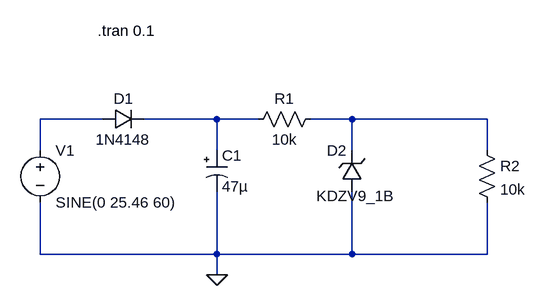
[diagram p0: schematic moduloAlimentacao.asc]
moduloAlimentacao.asc, the LTspice schematic file:
Version 4
SHEET 1 948 680
WIRE 288 48 192 48
WIRE 464 48 352 48
WIRE 528 48 464 48
WIRE 672 48 608 48
WIRE 880 48 672 48
WIRE 192 96 192 48
WIRE 464 96 464 48
WIRE 672 96 672 48
WIRE 880 96 880 48
WIRE 192 256 192 176
WIRE 464 256 464 160
WIRE 464 256 192 256
WIRE 672 256 672 160
WIRE 672 256 464 256
WIRE 880 256 880 176
WIRE 880 256 672 256
WIRE 464 288 464 256
FLAG 464 288 0
SYMBOL voltage 192 80 R0
WINDOW 123 0 0 Left 0
WINDOW 39 0 0 Left 0
SYMATTR InstName V1
SYMATTR Value SINE(0 25.46 60)
SYMBOL diode 288 64 R270
WINDOW 0 32 32 VTop 2
WINDOW 3 0 32 VBottom 2
SYMATTR InstName D1
SYMATTR Value 1N4148
SYMBOL polcap 448 96 R0
WINDOW 3 24 56 Left 2
SYMATTR Value 47µ
SYMATTR InstName C1
SYMATTR Description Capacitor
SYMATTR Type cap
SYMATTR SpiceLine V=4 Irms=0 Rser=2.4 Lser=0 mfg="AVX" pn="TAJB476M004" type="Tantalum"
SYMBOL zener 688 160 R180
WINDOW 0 24 64 Left 2
WINDOW 3 -49 -6 Left 2
SYMATTR InstName D2
SYMATTR Value KDZV9_1B
SYMBOL res 624 32 R90
WINDOW 0 0 56 VBottom 2
WINDOW 3 32 56 VTop 2
SYMATTR InstName R1
SYMATTR Value 10k
SYMBOL res 864 80 R0
SYMATTR InstName R2
SYMATTR Value 10k
TEXT 280 -88 Left 2 !.tran 0.1

The netlist it stands for:
* moduloAlimentacao.asc
V1 N001 0 SINE(0 25.46 60)
D1 N001 N002 1N4148
C1 N002 0 47µ V=4 Irms=0 Rser=2.4 Lser=0 mfg="AVX" pn="TAJB476M004" type="Tantalum"
D2 0 N003 KDZV9_1B
R1 N003 N002 10k
R2 N003 0 10k
.model D D
.lib standard.dio
.tran 0.1
.backanno
.end